# EasyEDA schematic JLPCB_DATA_LOGGER.json
TITLE: Data Logger; REV: 1.5; Date: 2023-07-03; Sheet: 1/1; Company: University of Arizona
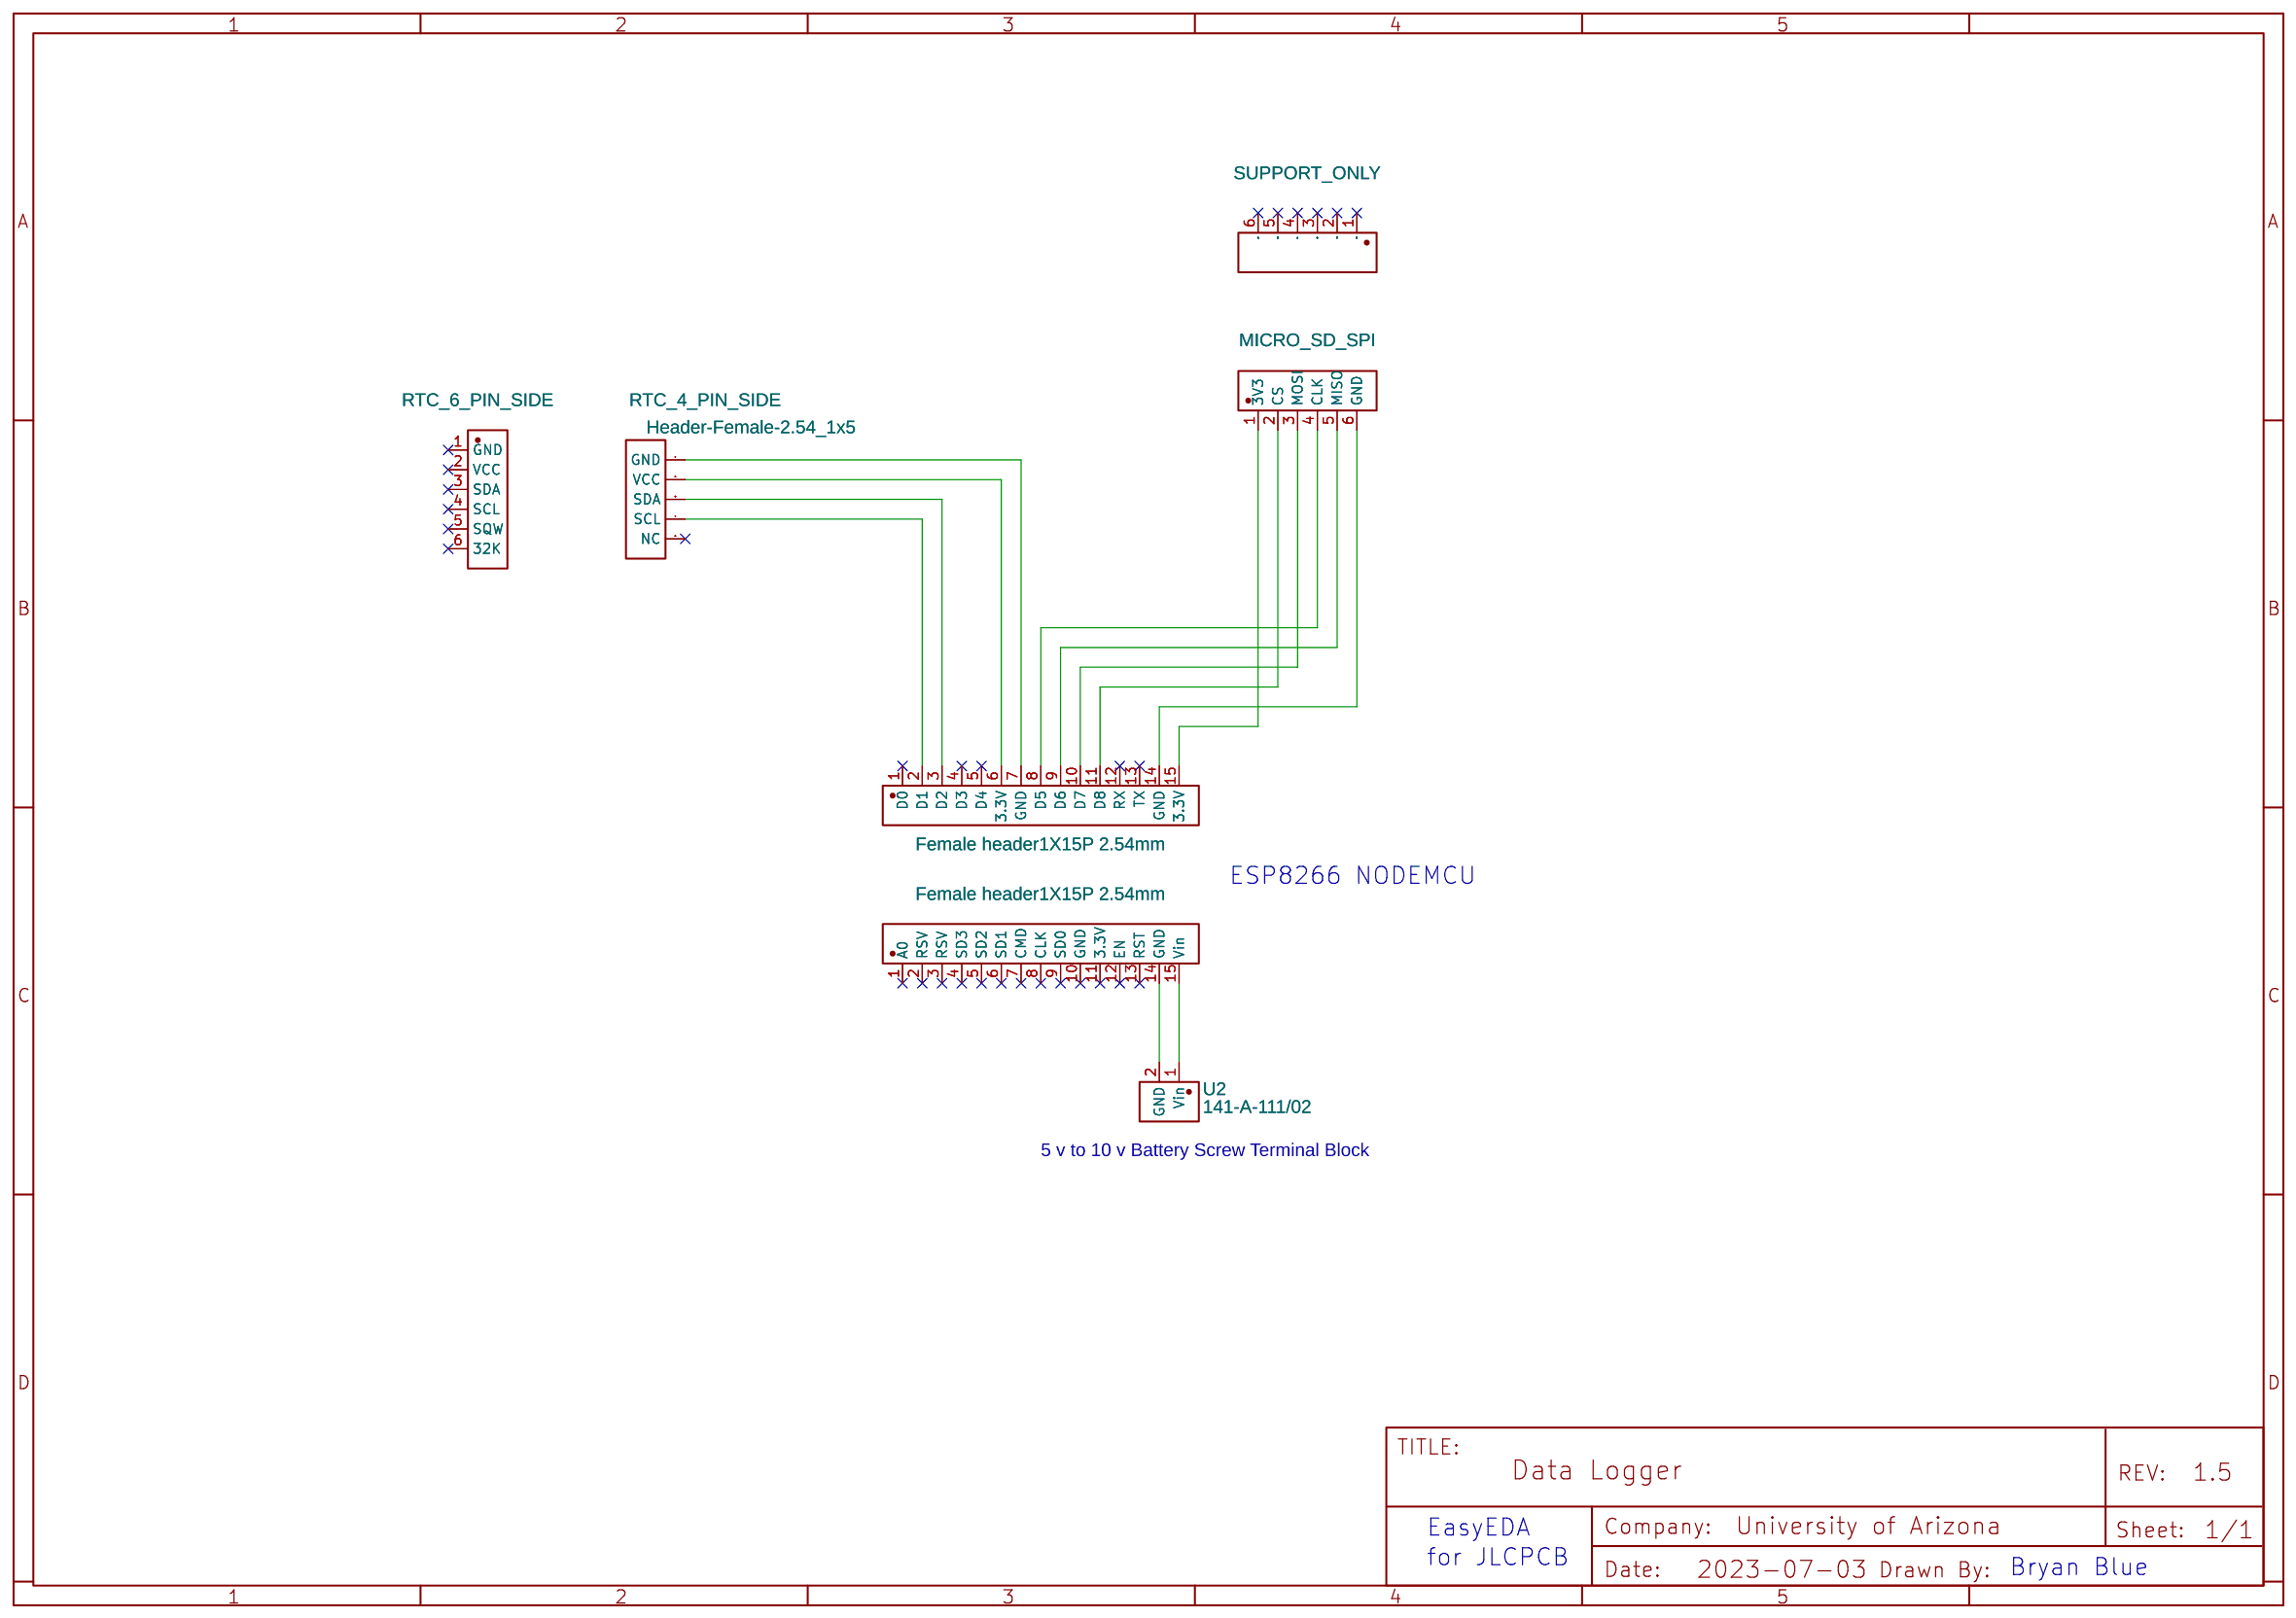
[diagram p0: schematic sheet]

## Parts
MICRO_SD_SPI  Header-Female-2.54_1x6  [HDR-TH_6P-P2.54-V-F]
P1  Female header1X15P 2.54mm  [HDR-TH_15P-P2.54-V-F]
P2  Female header1X15P 2.54mm  [HDR-TH_15P-P2.54-V-F]
RTC_4_PIN_SIDE  Header-Female-2.54_1x5  [HDR-TH_5P-P2.54-V-F]
RTC_6_PIN_SIDE  Header-Female-2.54_1x6  [HDR-TH_6P-P2.54-V-F]
SUPPORT_ONLY  Header-Female-2.54_1x6  [HDR-TH_6P-P2.54-V-F]
U2  141-A-111/02  [CONN-TH_2P-P5.08_WECO_141-A-111_02]

## Library data of the parts
MICRO_SD_SPI RTC_6_PIN_SIDE SUPPORT_ONLY = Header-Female-2.54_1x6: Supplier: LCSC; Manufacturer: BOOMELE(博穆精密); Manufacturer Part: 2.54-1*6P母; Supplier Part: C40877; JLCPCB Part Class: Extended Part
P1 P2 = Female header1X15P 2.54mm: Supplier Part: C54104; Supplier: LCSC; Manufacturer: ReliaPro; JLCPCB Part Class: Extended Part; Package Display: No
RTC_4_PIN_SIDE = Header-Female-2.54_1x5: Supplier: LCSC; Manufacturer: BOOMELE(博穆精密); Manufacturer Part: 2.54-1*5P母; Supplier Part: C50950; JLCPCB Part Class: Extended Part
U2 = 141-A-111/02: Supplier: LCSC; Supplier Part: C3011914; Manufacturer: WECO(威克德诺); link: https://atta.szlcsc.com/upload/public/pdf/source/20220628/02F0AB5EE846594F375BB2188017CA23.pdf; Contributor: lcsc; JLCPCB Part Class: Extended Part

## Nets
Net-(MICRO_SD_SPI-1): MICRO_SD_SPI.1(3V3) P2.15(3.3V)
Net-(MICRO_SD_SPI-2): MICRO_SD_SPI.2(CS) P2.11(D8)
Net-(MICRO_SD_SPI-3): MICRO_SD_SPI.3(MOSI) P2.10(D7)
Net-(MICRO_SD_SPI-4): MICRO_SD_SPI.4(CLK) P2.8(D5)
Net-(MICRO_SD_SPI-5): MICRO_SD_SPI.5(MISO) P2.9(D6)
Net-(MICRO_SD_SPI-6): MICRO_SD_SPI.6(GND) P2.14(GND)
Net-(P1-14): P1.14(GND) U2.2(GND)
Net-(P1-15): P1.15(Vin) U2.1(Vin)
Net-(P2-2): P2.2(D1) RTC_4_PIN_SIDE.4(SCL)
Net-(P2-3): P2.3(D2) RTC_4_PIN_SIDE.3(SDA)
Net-(P2-6): P2.6(3.3V) RTC_4_PIN_SIDE.2(VCC)
Net-(P2-7): P2.7(GND) RTC_4_PIN_SIDE.1(GND)

Not connected (* = marked no-connect by the designer): P1 1(A0)* 2(RSV)* 3(RSV)* 4(SD3)* 5(SD2)* 6(SD1)* 7(CMD)* 8(CLK)* 9(SD0)* 10(GND)* 11(3.3V)* 12(EN)* 13(RST)*; P2 1(D0)* 4(D3)* 5(D4)* 12(RX)* 13(TX)*; RTC_4_PIN_SIDE 5(NC)*; RTC_6_PIN_SIDE 1(GND)* 2(VCC)* 3(SDA)* 4(SCL)* 5(SQW)* 6(32K)*; SUPPORT_ONLY 1(3V3)* 2(CS)* 3(MOSI)* 4(CLK)* 5(MISO)* 6(GND)*

## Notes on the sheet
- ESP8266 NODEMCU
- 5 v to 10 v Battery Screw Terminal Block
- EasyEDA
- for JLCPCB
- Bryan Blue
